# EAGLE design DEGREE_V2 (EAGLE 9.1.2)
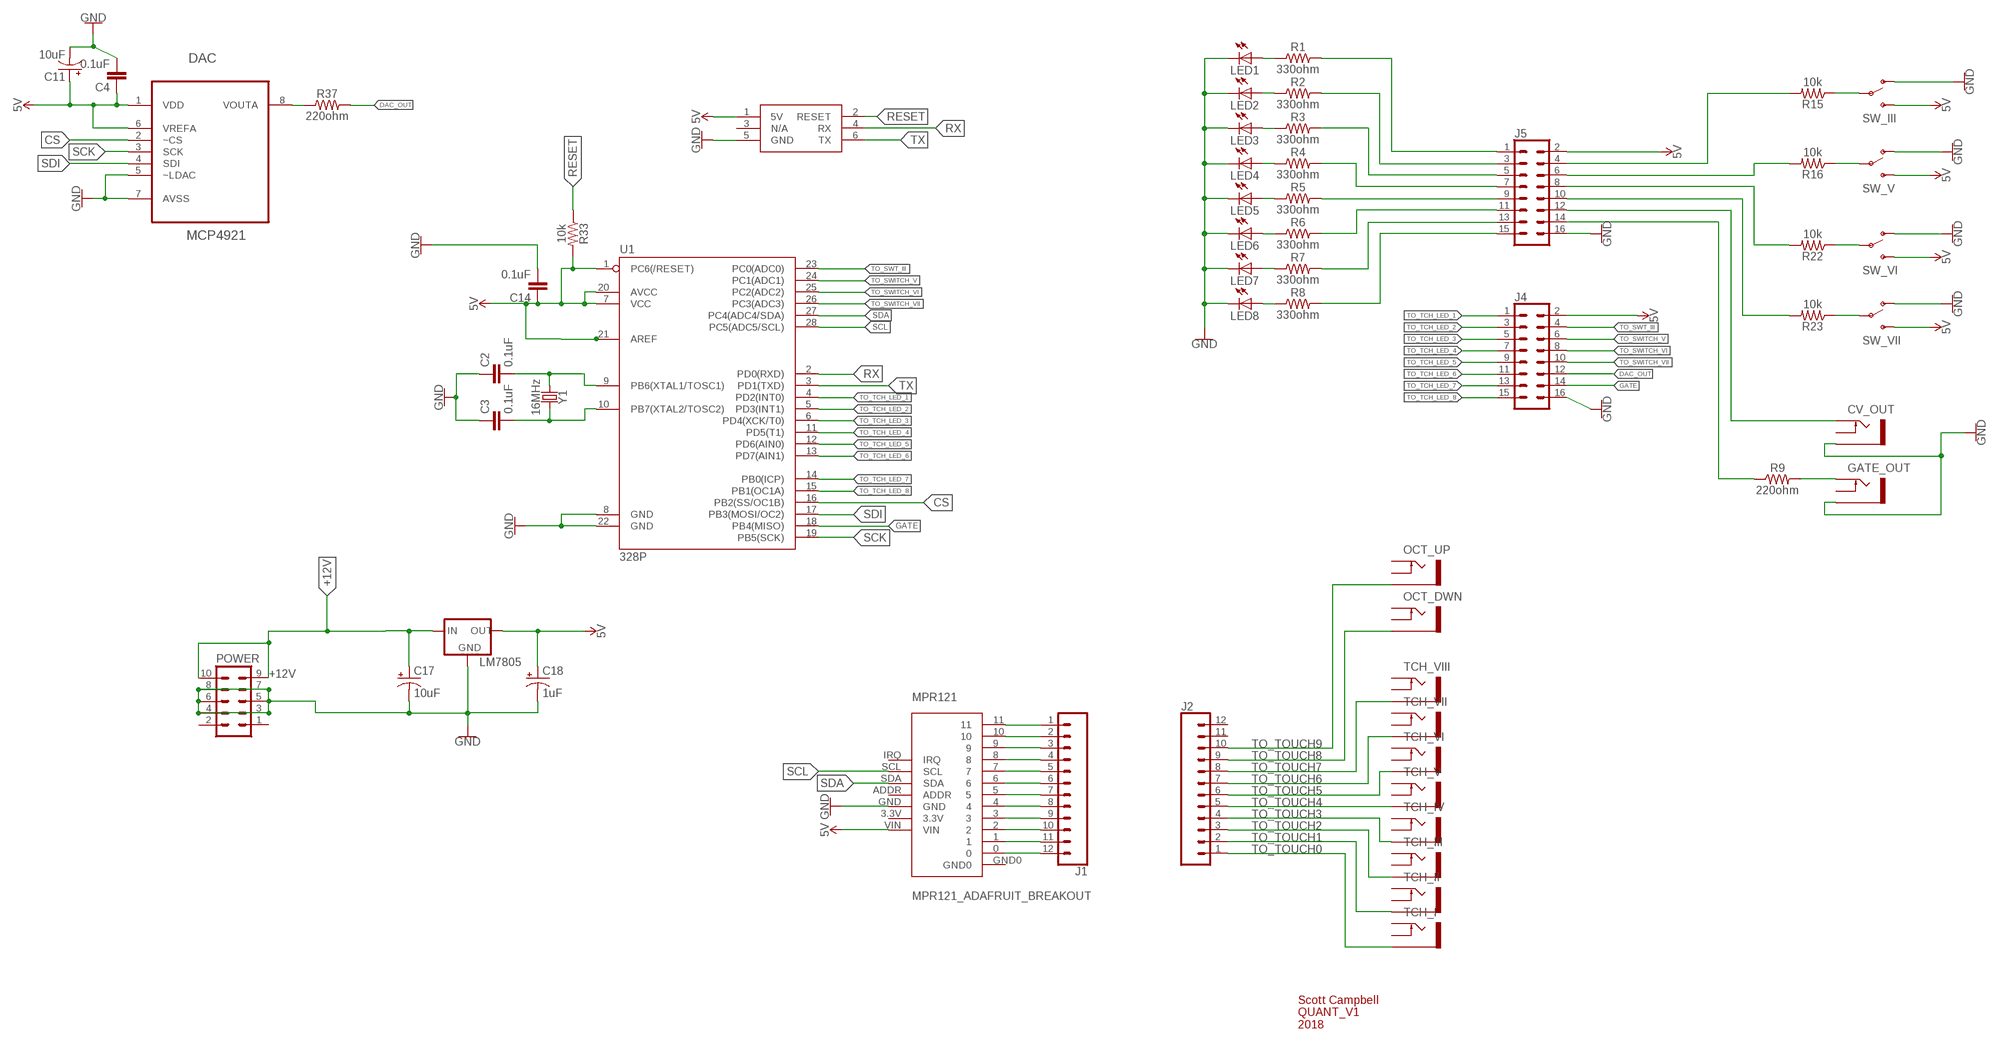
[diagram p0: schematic, sheet 1]

## Parts
C2  0.1uF  0.1UF-KIT-EZ-50V-20%  [CAP-PTH-SMALL-KIT]
C3  0.1uF  0.1UF-KIT-EZ-50V-20%  [CAP-PTH-SMALL-KIT]
C4  0.1uF  0.1UF-KIT-EZ-50V-20%  [CAP-PTH-SMALL-KIT]
C11  10uF  10UF-POLAR-RADIAL-2.5MM-25V-20%  [CPOL-RADIAL-2.5MM-5MM]
C14  0.1uF  0.1UF-KIT-EZ-50V-20%  [CAP-PTH-SMALL-KIT]
C17  10uF  10UF-POLAR-RADIAL-2.5MM-25V-20%  [CPOL-RADIAL-2.5MM-5MM]
C18  1uF  10UF-POLAR-RADIAL-2.5MM-25V-20%  [CPOL-RADIAL-2.5MM-5MM]
CV_OUT  CV_OUT  THONKICONNNEW  [WQP-PJ301M-12_JACK]
DAC  MCP4921  [DIP08]
GATE_OUT  GATE_OUT  THONKICONNNEW  [WQP-PJ301M-12_JACK]
J1  CONN_12  [1X12]
J2  CONN_12  [1X12]
J4  CONN_08X2  [2X8]
J5  CONN_08X2  [2X8]
LED1  LED3MM  [LED3MM]
LED2  LED3MM  [LED3MM]
LED3  LED3MM  [LED3MM]
LED4  LED3MM  [LED3MM]
LED5  LED3MM  [LED3MM]
LED6  LED3MM  [LED3MM]
LED7  LED3MM  [LED3MM]
LED8  LED3MM  [LED3MM]
LM7805  V_REG_78XXTO-92_UNTESTED  [TO-92]
MPR121  MPR121_ADAFRUIT_BREAKOUT  [MPR121_ADAFRUIT_BREAKOUT]
OCT_DWN  THONKICONN-ESSY  [THONKICONN-ESSY]
OCT_UP  THONKICONN-ESSY  [THONKICONN-ESSY]
POWER  EURO_POWER_HEADERREGULAR  [EURO_POWER_HEADER]
R1  330ohm  1KOHM-HORIZ-1/4W-5%  [AXIAL-0.3]
R2  330ohm  1KOHM-HORIZ-1/4W-5%  [AXIAL-0.3]
R3  330ohm  1KOHM-HORIZ-1/4W-5%  [AXIAL-0.3]
R4  330ohm  1KOHM-HORIZ-1/4W-5%  [AXIAL-0.3]
R5  330ohm  1KOHM-HORIZ-1/4W-5%  [AXIAL-0.3]
R6  330ohm  1KOHM-HORIZ-1/4W-5%  [AXIAL-0.3]
R7  330ohm  1KOHM-HORIZ-1/4W-5%  [AXIAL-0.3]
R8  330ohm  1KOHM-HORIZ-1/4W-5%  [AXIAL-0.3]
R9  220ohm  RESISTOR_HORZ  [HORIZONTAL_RESISTOR]
R15  10k  RESISTOR_HORZ  [HORIZONTAL_RESISTOR]
R16  10k  RESISTOR_HORZ  [HORIZONTAL_RESISTOR]
R22  10k  RESISTOR_HORZ  [HORIZONTAL_RESISTOR]
R23  10k  RESISTOR_HORZ  [HORIZONTAL_RESISTOR]
R33  10k  RESISTOR_HORZ  [HORIZONTAL_RESISTOR]
R37  220ohm  RESISTOR_VERT  [VERTICAL_RESISTOR]
SW_III  SUBMINI_SPDT  [SUBMINI_TOGGLE]
SW_V  SUBMINI_SPDT  [SUBMINI_TOGGLE]
SW_VI  SUBMINI_SPDT  [SUBMINI_TOGGLE]
SW_VII  SUBMINI_SPDT  [SUBMINI_TOGGLE]
TCH_I  THONKICONN-ESSY  [THONKICONN-ESSY]
TCH_II  THONKICONN-ESSY  [THONKICONN-ESSY]
TCH_III  THONKICONN-ESSY  [THONKICONN-ESSY]
TCH_IV  THONKICONN-ESSY  [THONKICONN-ESSY]
TCH_V  THONKICONN-ESSY  [THONKICONN-ESSY]
TCH_VI  THONKICONN-ESSY  [THONKICONN-ESSY]
TCH_VII  THONKICONN-ESSY  [THONKICONN-ESSY]
TCH_VIII  THONKICONN-ESSY  [THONKICONN-ESSY]
U1  328P  ATMEGA328P_PDIP  [DIP28]
U$1  ATMEGA_PROGRAMMING_PINS  [ATMEGA_PROGRAMMING_PINS]
Y1  16MHz  CRYSTAL-16MHZPTH-HC49US  [HC49US]

## Nets
5V: C4.1 C11.1(+) C14.1 C18.1(+) DAC.1(VDD) DAC.6(VREFA) J4.2 J5.2 LM7805.1(OUT) MPR121.VIN R33.2 SW_III.3(S) SW_V.3(S) SW_VI.3(S) SW_VII.3(S) U1.1(PC6(/RESET)) U1.7(VCC) U1.20(AVCC) U1.21(AREF) U$1.1(5V)
+12V: C17.1(+) LM7805.3(IN) POWER.9 POWER.10
CS: DAC.2(~CS) U1.16(PB2(SS/OC1B))
DAC_OUT: J4.12 R37.2
GATE: J4.14 U1.18(PB4(MISO))
GND: C2.1 C3.1 C4.2 C11.2(-) C14.2 C17.2(-) C18.2(-) CV_OUT.P$3_SLEEVE(SLEEVE) DAC.5(~LDAC) DAC.7(AVSS) GATE_OUT.P$3_SLEEVE(SLEEVE) J4.16 J5.16 LED1.K(C) LED2.K(C) LED3.K(C) LED4.K(C) LED5.K(C) LED6.K(C) LED7.K(C) LED8.K(C) LM7805.2(GND) MPR121.GND POWER.3 POWER.4 POWER.5 POWER.6 POWER.7 POWER.8 SW_III.1(O) SW_V.1(O) SW_VI.1(O) SW_VII.1(O) U1.8(GND) U1.22(GND) U$1.5(GND)
N$1: DAC.8(VOUTA) R37.1
N$2: GATE_OUT.P$1_TIP(TIP) R9.2
N$4: R23.1 SW_VII.COM(COMMON)
N$5: R22.1 SW_VI.COM(COMMON)
N$6: R16.1 SW_V.COM(COMMON)
N$7: R15.1 SW_III.COM(COMMON)
N$9: C3.2 U1.10(PB7(XTAL2/TOSC2)) Y1.2
N$11: C2.2 U1.9(PB6(XTAL1/TOSC1)) Y1.1
N$15: J5.4 R15.2
N$16: J5.6 R16.2
N$20: J5.8 R22.2
N$21: J1.1 MPR121.11
N$22: J5.10 R23.2
N$25: J1.2 MPR121.10
N$31: J1.3 MPR121.9
N$34: J1.4 MPR121.8
N$37: J1.5 MPR121.7
N$38: J1.6 MPR121.6
N$39: J1.7 MPR121.5
N$40: CV_OUT.P$1_TIP(TIP) J5.12
N$41: J5.14 R9.1
N$42: LED1.A R1.P$1
N$43: LED2.A R2.P$1
N$44: J1.8 MPR121.4
N$45: J1.9 MPR121.3
N$46: J1.10 MPR121.2
N$47: J1.11 MPR121.1
N$48: J1.12 MPR121.0
N$50: LED3.A R3.P$1
N$51: LED4.A R4.P$1
N$52: LED5.A R5.P$1
N$53: LED6.A R6.P$1
N$54: LED7.A R7.P$1
N$55: LED8.A R8.P$1
RESET: R33.1 U$1.2(RESET)
RX: U1.2(PD0(RXD)) U$1.4(RX)
SCK: DAC.3(SCK) U1.19(PB5(SCK))
SCL: MPR121.SCL U1.28(PC5(ADC5/SCL))
SDA: MPR121.SDA U1.27(PC4(ADC4/SDA))
SDI: DAC.4(SDI) U1.17(PB3(MOSI/OC2))
TCH_LED_1: J5.1 R1.P$2
TCH_LED_2: J5.3 R2.P$2
TCH_LED_3: J5.5 R3.P$2
TCH_LED_4: J5.7 R4.P$2
TCH_LED_5: J5.9 R5.P$2
TCH_LED_6: J5.11 R6.P$2
TCH_LED_7: J5.13 R7.P$2
TCH_LED_8: J5.15 R8.P$2
TO_SWITCH_V: J4.6 U1.24(PC1(ADC1))
TO_SWITCH_VI: J4.8 U1.25(PC2(ADC2))
TO_SWITCH_VII: J4.10 U1.26(PC3(ADC3))
TO_SWT_III: J4.4 U1.23(PC0(ADC0))
TO_TCH_LED_1: J4.1 U1.4(PD2(INT0))
TO_TCH_LED_2: J4.3 U1.5(PD3(INT1))
TO_TCH_LED_3: J4.5 U1.6(PD4(XCK/T0))
TO_TCH_LED_4: J4.7 U1.11(PD5(T1))
TO_TCH_LED_5: J4.9 U1.12(PD6(AIN0))
TO_TCH_LED_6: J4.11 U1.13(PD7(AIN1))
TO_TCH_LED_7: J4.13 U1.14(PB0(ICP))
TO_TCH_LED_8: J4.15 U1.15(PB1(OC1A))
TO_TOUCH0: J2.1 TCH_I.P$3_SLEEVE(SLEEVE)
TO_TOUCH1: J2.2 TCH_II.P$3_SLEEVE(SLEEVE)
TO_TOUCH2: J2.3 TCH_III.P$3_SLEEVE(SLEEVE)
TO_TOUCH3: J2.4 TCH_IV.P$3_SLEEVE(SLEEVE)
TO_TOUCH4: J2.5 TCH_V.P$3_SLEEVE(SLEEVE)
TO_TOUCH5: J2.6 TCH_VI.P$3_SLEEVE(SLEEVE)
TO_TOUCH6: J2.7 TCH_VII.P$3_SLEEVE(SLEEVE)
TO_TOUCH7: J2.8 TCH_VIII.P$3_SLEEVE(SLEEVE)
TO_TOUCH8: J2.9 OCT_DWN.P$3_SLEEVE(SLEEVE)
TO_TOUCH9: J2.10 OCT_UP.P$3_SLEEVE(SLEEVE)
TX: U1.3(PD1(TXD)) U$1.6(TX)
Unconnected: CV_OUT.P$2_SWITCH(SWITCH) GATE_OUT.P$2_SWITCH(SWITCH) J2.11 J2.12 MPR121.3.3V MPR121.ADDR MPR121.GND0 MPR121.IRQ OCT_DWN.P$1_TIP(TIP) OCT_DWN.P$2_SWITCH(SWITCH) OCT_UP.P$1_TIP(TIP) OCT_UP.P$2_SWITCH(SWITCH) POWER.1 POWER.2 TCH_I.P$1_TIP(TIP) TCH_I.P$2_SWITCH(SWITCH) TCH_II.P$1_TIP(TIP) TCH_II.P$2_SWITCH(SWITCH) TCH_III.P$1_TIP(TIP) TCH_III.P$2_SWITCH(SWITCH) TCH_IV.P$1_TIP(TIP) TCH_IV.P$2_SWITCH(SWITCH) TCH_V.P$1_TIP(TIP) TCH_V.P$2_SWITCH(SWITCH) TCH_VI.P$1_TIP(TIP) TCH_VI.P$2_SWITCH(SWITCH) TCH_VII.P$1_TIP(TIP) TCH_VII.P$2_SWITCH(SWITCH) TCH_VIII.P$1_TIP(TIP) TCH_VIII.P$2_SWITCH(SWITCH) U$1.3(N/A)

## Notes on the sheet
- Scott Campbell
  QUANT_V1
  2018

## Library data of the parts
C2-C4 C14 = SparkFun-Capacitors:0.1UF: 0.1µF ceramic capacitors A capacitor is a passive two-terminal electrical component used to store electrical energy temporarily in an electric field.; PROD_ID: CAP-08370
C11 C17 = SparkFun-Capacitors:10UF-POLAR: 10.0µF polarized capacitors A capacitor is a passive two-terminal electrical component used to store electrical energy temporarily in an electric field.; PROD_ID: CAP-08440
C18 = SparkFun-Capacitors:10UF-POLAR: 10.0µF polarized capacitors A capacitor is a passive two-terminal electrical component used to store electrical energy temporarily in an electric field.; PROD_ID: CAP-08440; VALUE: 10uF
CV_OUT GATE_OUT = MusicThingModular:THONKICONN: 3.5mm socket for Eurorack modular synths
DAC = ESSY:MCP4921
J1 J2 = SparkFun-Connectors:CONN_12: Multi connection point. Often used as Generic Header-pin footprint for 0.1 inch spaced/style header connections On any of the 0.1 inch spaced packages, you can populate with these: Break Away Headers - Straight <https://www.sparkfun.com/products/116> (PRT-00116) Break Away Male Headers - Right Angle <https://www.sparkfun.com/products/553> (PRT-00553) Female Headers <https://www.sparkfun.com/products/115> (PRT-00115) Break Away Headers - Machine Pin <https://www.sparkfun.com/products/117> (PRT-00117) Break Away Female Headers - Swiss Machine Pin <https://www.sparkfun.com/products/743> (PRT-00743) For SCREWTERMINALS and SPRING TERMINALS visit here: Screw Terimnals on SparkFun.com <https://www.sparkfun.com/search/results?term=Screw+Terminals> (5mm/3.5mm/2.54mm spacing) This device is also useful as a general connection point to wire up your design to another part of your project. Our various solder wires solder well into these plated through hole pads. Hook-Up Wire - Assortment (Stranded, 22 AWG) <https://www.sparkfun.com/products/11375> (PRT-11375) Hook-Up Wire - Assortment (Solid Core, 22 AWG) <https://www.sparkfun.com/products/11367> (PRT-11367) View the entire wire category on our website here <https://www.sparkfun.com/categories/141> Special notes: Molex polarized connector foot print use with SKU : PRT-08231 with associated crimp pins and housings. 1MM SMD Version SKU: PRT-10208 NOTES ON THE VARIANTS LOCK and LOCK_LONGPADS... This footprint was designed to help hold the alignment of a through-hole component (i.e. 6-pin header) while soldering it into place. You may notice that each hole has been shifted either up or down by 0.005 of an inch from it's more standard position (which is a perfectly straight line). This slight alteration caused the pins (the squares in the middle) to touch the edges of the holes. Because they are alternating, it causes a "brace" to hold the component in place. 0.005 has proven to be the perfect amount of "off-center" position when using our standard breakaway headers. Although looks a little odd when you look at the bare footprint, once you have a header in there, the alteration is very hard to notice. Also,if you push a header all the way into place, it is covered up entirely on the bottom side.
J4 J5 = SparkFun-Connectors:CONN_08X2: Multi connection point. Often used as Generic Header-pin footprint for 0.1 inch spaced/style header connections You can populate with any combo of single row headers, but if you'd like an exact match, check this: Header - 2x8 (Male, 0.1") <https://www.sparkfun.com/products/13156> (PRT-13156) On any of the 0.1 inch spaced packages, you can populate with these: Break Away Headers - Straight <https://www.sparkfun.com/products/116> (PRT-00116) Break Away Male Headers - Right Angle <https://www.sparkfun.com/products/553> (PRT-00553) Female Headers <https://www.sparkfun.com/products/115> (PRT-00115) Break Away Headers - Machine Pin <https://www.sparkfun.com/products/117> (PRT-00117) Break Away Female Headers - Swiss Machine Pin <https://www.sparkfun.com/products/743> (PRT-00743)
LED1-LED8 = adafruit:LED: LED OSRAM: - CHIPLED LG R971, LG N971, LY N971, LG Q971, LY Q971, LO R971, LY R971 LH N974, LH R974 LS Q976, LO Q976, LY Q976 LO Q996 - Hyper CHIPLED LW Q18S LB Q993, LB Q99A, LB R99A - SideLED LS A670, LO A670, LY A670, LG A670, LP A670 LB A673, LV A673, LT A673, LW A673 LH A674 LY A675 LS A676, LA A676, LO A676, LY A676, LW A676 LS A679, LY A679, LG A679 - Hyper Micro SIDELED® LS Y876, LA Y876, LO Y876, LY Y876 LT Y87S - SmartLED LW L88C, LW L88S LB L89C, LB L89S, LG L890 LS L89K, LO L89K, LY L89K LS L896, LA L896, LO L896, LY L896 - TOPLED LS T670, LO T670, LY T670, LG T670, LP T670 LSG T670, LSP T670, LSY T670, LOP T670, LYG T670 LG T671, LOG T671, LSG T671 LB T673, LV T673, LT T673, LW T673 LH T674 LS T676, LA T676, LO T676, LY T676, LB T676, LH T676, LSB T676, LW T676 LB T67C, LV T67C, LT T67C, LS T67K, LO T67K, LY T67K, LW E67C LS E67B, LA E67B, LO E67B, LY E67B, LB E67C, LV E67C, LT E67C LW T67C LS T679, LY T679, LG T679 LS T770, LO T770, LY T770, LG T770, LP T770 LB T773, LV T773, LT T773, LW T773 LH T774 LS E675, LA E675, LY E675, LS T675 LS T776, LA T776, LO T776, LY T776, LB T776 LHGB T686 LT T68C, LB T68C - Hyper Mini TOPLED® LB M676 - Mini TOPLED Santana® LG M470 LS M47K, LO M47K, LY M47K Source: http://www.osram.convergy.de/
LM7805 = SparkFun-IC-Power:V_REG_78XX: Voltage Regulator Standard 78xx regulator. IGO (Input Ground Output). Spark Fun Electronics SKU : COM-00107
MPR121 = ESSY:MPR121_ADAFRUIT_BREAKOUT
OCT_DWN OCT_UP TCH_I TCH_II TCH_III TCH_IV TCH_V TCH_VI TCH_VII TCH_VIII = ESSY:THONKICONN-ESSY
POWER = MusicThingModular:EURO_POWER_HEADER: Power Header 10 pin power header for Eurorack Power Supplies Variants with fatter pads for easier soldering, and the LOCK variant which has 5mil offset pins to hold the component in place before soldering
R1-R8 = SparkFun-Resistors:1KOHM: 1kΩ resistor A resistor is a passive two-terminal electrical component that implements electrical resistance as a circuit element. Resistors act to reduce current flow, and, at the same time, act to lower voltage levels within circuits. - Wikipedia; PROD_ID: RES-08380; VALUE: 1k
R9 R15 R16 R22 R23 R33 = ESSY:RESISTOR_HORZ
R37 = ESSY:RESISTOR_VERT
SW_III SW_V SW_VI SW_VII = MusicThingModular:SUBMINI_SPDT
U1 = SparkFun-IC-Microcontroller:ATMEGA328P_PDIP: Atmel 328P Through hole ATMEGA328P uC used in the Arduino 32kb flash, 1k EEPROM, 2k SRAM Datasheet <http://www.sparkfun.com/datasheets/Components/SMD/ATMega328.pdf> SparkFun Products Storefront component: AVR 28 Pin 20MHz 32K 6A/D - ATMega328P <https://www.sparkfun.com/products/9061> (COM-09061) SparkFun Simon Says - Through-Hole Soldering Kit <https://www.sparkfun.com/products/10547> (KIT-10547) SparkFun Learn to Solder - Simon Says <https://www.sparkfun.com/products/13708> (KIT-13708) SparkFun BigTime Watch Kit <https://www.sparkfun.com/products/11734> (KIT-11734) SparkFun ClockIt <https://www.sparkfun.com/products/10930> (KIT-10930) SparkFun Serial Enabled LCD Kit <https://www.sparkfun.com/products/10097> (LCD-10097) SparkFun Simon Tilts - Through Hole Soldering Kit <https://www.sparkfun.com/products/12634> (KIT-12634) SparkFun Frequency Counter Kit <https://www.sparkfun.com/products/10140> (KIT-10140) FabFM Radio Kit <https://www.sparkfun.com/products/11043> (KIT-11043) SparkFun Binary Blaster Kit <https://www.sparkfun.com/products/12037> (KIT-12037) SparkFun Metro-Gnome <https://www.sparkfun.com/products/9236> (KIT-09236) ATmega328 with Arduino Optiboot (Uno) <https://www.sparkfun.com/products/10524> (DEV-10524); PROD_ID: IC-09136
U$1 = ESSY:ATMEGA_PROGRAMMING_PINS
Y1 = SparkFun-Clocks:CRYSTAL-16MHZ: 16MHz Crystal Digikey Example <http://www.digikey.com/product-search/en?keywords=535-9122-1-ND> Frequency: 16MHz Frequency Stability: ±50ppm Frequency Tolerance: ±20ppm Load Capacitance: 18pF SparkFun Products: Pro Micro -5V/16MHz <https://www.sparkfun.com/products/12640> SparkFun Serial Enabled LCD Kit <https://www.sparkfun.com/products/10097>; PROD_ID: XTAL-08181; SF_ID: COM-00536

## Board
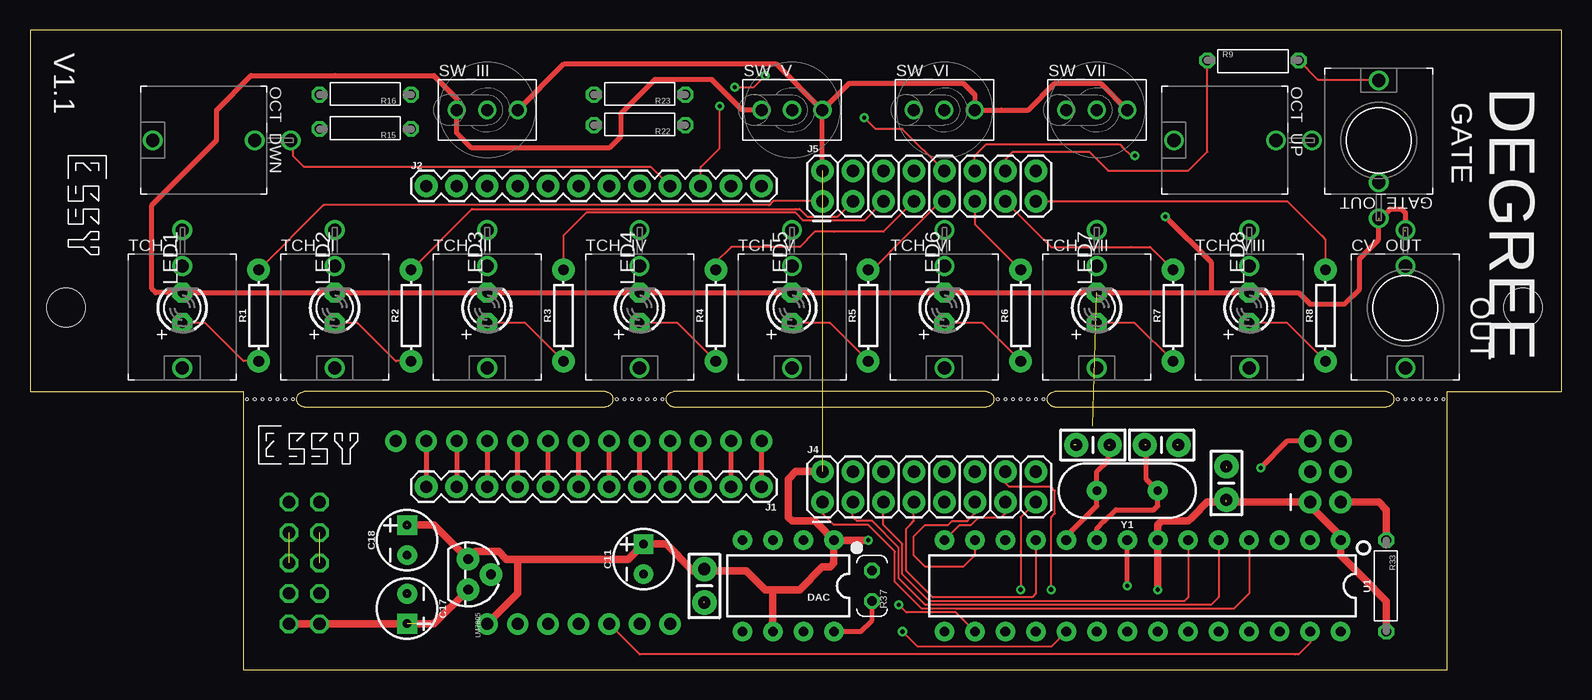
[diagram p1: board, top side]
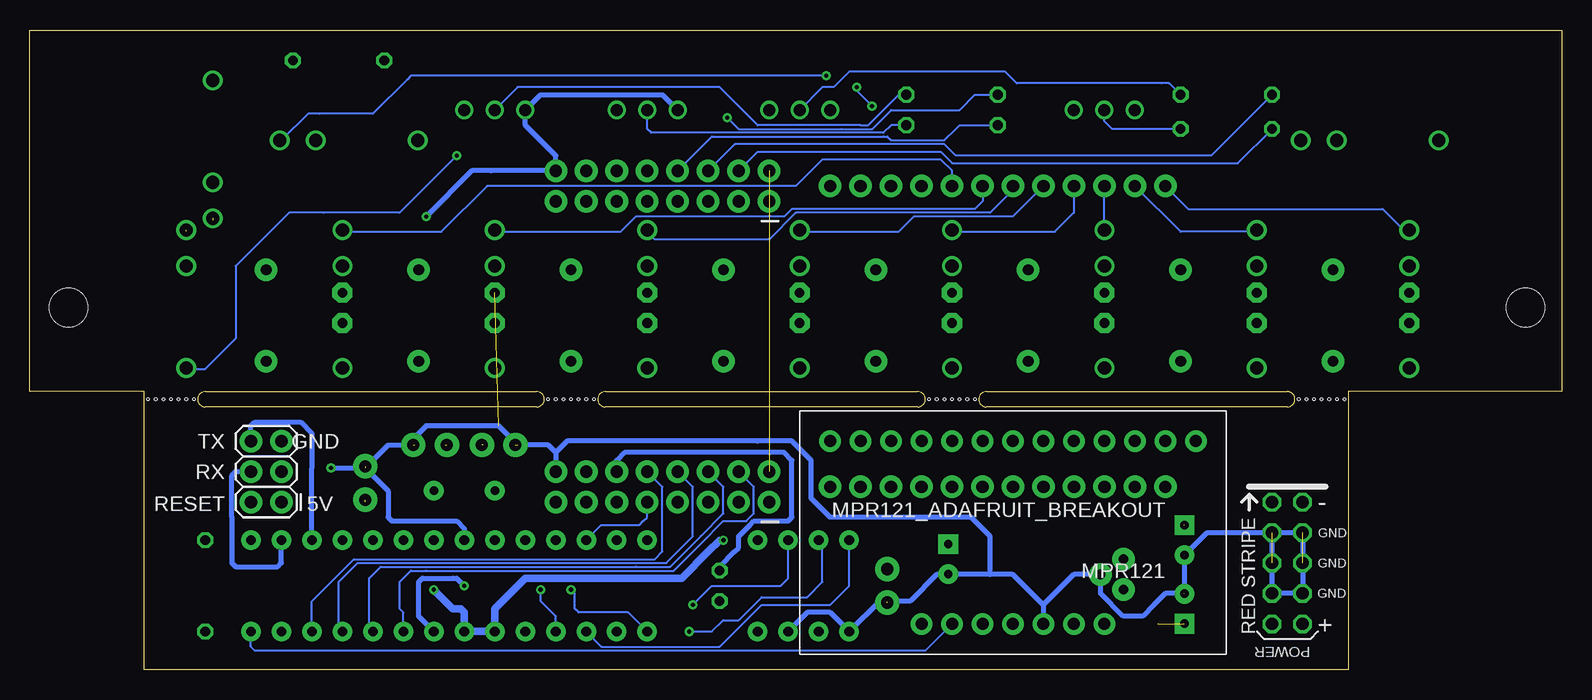
[diagram p2: board, bottom side, seen from below]

Size 127.64 x 53.34 mm. Coordinates in mm from the lower left corner, seen from the top.
Outline: 17.78,0 118.11,0 118.11,23.18 127.64,23.18 127.64,53.34 0,53.33 0,23.18 17.78,23.18 17.78,0
Outline: 22.86,21.91 47.94,21.91 arc180 47.94,23.18 22.86,23.18 arc180 22.86,21.91
Outline: 85.41,21.91 113.03,21.91 arc180 113.03,23.18 85.41,23.18 arc180 85.41,21.91
Outline: 53.66,21.91 79.69,21.91 arc180 79.69,23.18 53.66,23.18 arc180 53.66,21.91
Copper layers (1*16): Top 0.035mm / dielectric 1.5mm / Bottom 0.035mm
Design rules "default": minimum track width 6mil, minimum drill 0.35mm, track to track 6mil, track to pad 6mil, pad to pad 6mil, via to via 6mil, smd to smd 6mil, copper to edge 40mil, drill to drill 6mil, minimum pad ring 10mil, minimum via ring 8mil, stop-mask expansion 4mil, vias tented up to drill 0mil, thermal gap 10mil
Holes 0.2 mm at 18.1,22.54 18.73,22.54 19.37,22.54 20,22.54 20.64,22.54 81.92,22.54 82.55,22.54 83.19,22.54 83.82,22.54 84.45,22.54 115.25,22.54 115.89,22.54 116.52,22.54 117.16,22.54 117.79,22.54 48.9,22.54 49.53,22.54 50.16,22.54 50.8,22.54 51.44,22.54 81.28,22.54 80.64,22.54 52.07,22.54 52.7,22.54 21.27,22.54 21.91,22.54 114.62,22.54 113.98,22.54

### Footprints (pad centres in the part's own frame; a part is rotated, then mirrored left to right if it is on the bottom)
CAP-PTH-SMALL-KIT = drill 1.016 pad 2.032: 1 -1.397,0; 2 1.397,0
CPOL-RADIAL-2.5MM-5MM = drill 0.7 pad 1.651 square: 1 1.25,0 | drill 0.7 pad 1.651: 2 -1.25,0
WQP-PJ301M-12_JACK = drill 1.1: P$1_TIP 0,5; P$2_SWITCH 0,-3.5; P$3_SLEEVE 0,-6.5
DIP08 = drill 0.813 pad 1.626: 1 -3.81,-3.81; 2 -1.27,-3.81; 3 1.27,-3.81; 4 3.81,-3.81; 5 3.81,3.81; 6 1.27,3.81; 7 -1.27,3.81; 8 -3.81,3.81
1X12 = drill 1.016 pad 1.88: 1 0,0; 2 2.54,0; 3 5.08,0; 4 7.62,0; 5 10.16,0; 6 12.7,0; 7 15.24,0; 8 17.78,0; 9 20.32,0; 10 22.86,0; 11 25.4,0; 12 27.94,0
2X8 = drill 1.016 pad 1.88: 1 0,0; 2 0,2.54; 3 2.54,0; 4 2.54,2.54; 5 5.08,0; 6 5.08,2.54; 7 7.62,0; 8 7.62,2.54; 9 10.16,0; 10 10.16,2.54; 11 12.7,0; 12 12.7,2.54; 13 15.24,0; 14 15.24,2.54; 15 17.78,0; 16 17.78,2.54
LED3MM = drill 0.813 pad 1.676 octagon: A -1.27,0; K 1.27,0
TO-92 = drill 0.813 pad 1.88: 1 -1.27,0; 2 0,1.905; 3 1.27,0
MPR121_ADAFRUIT_BREAKOUT = drill 1 pad 1.778: 0 17.78,-30.48; 1 17.78,-27.94; 2 17.78,-25.4; 3 17.78,-22.86; 3.3V 2.54,-22.86; 4 17.78,-20.32; 5 17.78,-17.78; 6 17.78,-15.24; 7 17.78,-12.7; 8 17.78,-10.16; 9 17.78,-7.62; 10 17.78,-5.08; 11 17.78,-2.54; ADDR 2.54,-17.78; GND 2.54,-20.32; GND0 17.78,-33.02; IRQ 2.54,-10.16; SCL 2.54,-12.7; SDA 2.54,-15.24; VIN 2.54,-25.4
THONKICONN-ESSY = drill 1.1: P$1_TIP 0,5; P$2_SWITCH 0,-3.5; P$3_SLEEVE 0,-6.5
EURO_POWER_HEADER = drill 1.016 octagon: 1 -5.08,-1.27; 2 -5.08,1.27; 3 -2.54,-1.27; 4 -2.54,1.27; 5 0,-1.27; 6 0,1.27; 7 2.54,-1.27; 8 2.54,1.27; 9 5.08,-1.27; 10 5.08,1.27
AXIAL-0.3 = drill 0.9 pad 1.88: P$1 -3.81,0; P$2 3.81,0
HORIZONTAL_RESISTOR = drill 0.813 octagon: 1 -3.81,0; 2 3.81,0
VERTICAL_RESISTOR = drill 0.813 octagon: 1 -1.27,0; 2 1.27,0
SUBMINI_TOGGLE = drill 1 pad 1.422: 1 -2.54,0; 3 2.54,0; COM 0,0
DIP28 = drill 0.813 pad 1.626: 1 -16.51,-3.81; 2 -13.97,-3.81; 3 -11.43,-3.81; 4 -8.89,-3.81; 5 -6.35,-3.81; 6 -3.81,-3.81; 7 -1.27,-3.81; 8 1.27,-3.81; 9 3.81,-3.81; 10 6.35,-3.81; 11 8.89,-3.81; 12 11.43,-3.81; 13 13.97,-3.81; 14 16.51,-3.81; 15 16.51,3.81; 16 13.97,3.81; 17 11.43,3.81; 18 8.89,3.81; 19 6.35,3.81; 20 3.81,3.81; 21 1.27,3.81; 22 -1.27,3.81; 23 -3.81,3.81; 24 -6.35,3.81; 25 -8.89,3.81; 26 -11.43,3.81; 27 -13.97,3.81; 28 -16.51,3.81
ATMEGA_PROGRAMMING_PINS = drill 1.016 pad 1.88: 1 0,0; 2 0,2.54; 3 2.54,0; 4 2.54,2.54; 5 5.08,0; 6 5.08,2.54
EURO_PANEL_SCREW_HOLE = hole 3.2: -0.032,0.032
HC49US = drill 0.7 pad 1.651: 1 -2.54,0; 2 2.54,0

### Placement (x,y rotation side)
C2  94.3,18.73 180 top
C3  88.58,18.73 0 top
C4  56.2,6.99 270 top
C11  51.12,9.21 90 top
C14  99.69,15.56 90 top
C17  31.43,5.08 270 top
C18  31.43,10.79 90 top
CV_OUT  114.62,30.16 180 top
DAC  63.18,6.99 180 top
GATE_OUT  112.39,44.13 0 top
J1  60.96,15.24 180 top
J2  33.02,40.32 0 top
J4  66.04,13.97 0 top
J5  66.04,39.05 0 top
LED1  12.7,30.16 90 top
LED2  25.4,30.16 90 top
LED3  38.1,30.16 90 top
LED4  50.8,30.16 90 top
LED5  63.5,30.16 90 top
LED6  76.2,30.16 90 top
LED7  88.9,30.16 90 top
LED8  101.6,30.16 90 top
LM7805  36.51,7.94 270 top
MPR121  63.5,1.27 90 bottom
OCT_DWN  15.24,44.13 90 top
OCT_UP  100.33,44.13 90 top
POWER  22.86,8.89 270 bottom
R1  19.05,29.53 90 top
R2  31.75,29.53 90 top
R3  44.45,29.53 90 top
R4  57.15,29.53 90 top
R5  69.85,29.53 90 top
R6  82.55,29.53 90 top
R7  95.25,29.53 90 top
R8  107.95,29.53 90 top
R9  101.92,50.8 0 top
R15  27.94,45.09 180 top
R16  27.94,47.94 180 top
R22  50.8,45.4 180 top
R23  50.8,47.94 180 top
R33  113.03,6.99 270 top
R37  70.17,6.99 90 top
SW_III  38.1,46.67 0 top
SW_V  63.5,46.67 0 top
SW_VI  76.2,46.67 0 top
SW_VII  88.9,46.67 0 top
TCH_I  12.7,30.16 180 top
TCH_II  25.4,30.16 180 top
TCH_III  38.1,30.16 180 top
TCH_IV  50.8,30.16 180 top
TCH_V  63.5,30.16 180 top
TCH_VI  76.2,30.16 180 top
TCH_VII  88.9,30.16 180 top
TCH_VIII  101.6,30.16 180 top
U1  92.71,6.99 180 top
U$1  106.68,13.97 90 bottom
U$2  [LOGO_SM]  6.35,42.86 270 top
U$3  [EURO_PANEL_SCREW_HOLE]  3.04,30.16 0 top
U$4  [EURO_PANEL_SCREW_HOLE]  124.46,30.16 0 top
U$6  [LOGO_SM]  19.05,20.32 0 top
Y1  91.44,14.92 180 top

### Tracks (layer width: path | path; a pad name or v marks a point on that pad's centre or on a via)
5V  (via drill 0.35)  (3 unrouted)
  Top 0.152: LM7805.1 36.83,9.21 | C11.1 51.12,10.48 | C4.1 56.2,8.26
  Top 0.406: J5.2 SW_V.3 | 106.68,13.65 U$1.1 | SW_V.3 68.26,48.9 77.79,48.9 78.74,47.94 SW_VI.3 80.96,46.67 83.19,46.67 85.41,48.9 89.22,48.9 SW_VII.3 | SW_V.3 62.23,50.48 44.45,50.48 SW_III.3
  Top 0.61: 106.68,13.65 107.95,12.38 109.22,11.11 U1.1 109.22,9.52 111.12,7.62 113.03,5.71 R33.2 | 40.64,9.21 45.4,9.21 49.85,9.21 51.12,10.48 53.02,10.48 55.24,8.26 56.2,8.26 59.69,8.26 61.28,6.67 61.91,6.67 | 40.64,9.21 39.69,9.21 39.05,9.84 37.15,9.84 LM7805.1 33.66,12.07 31.43,12.07 | MPR121.VIN 40.64,6.35 40.64,9.21 | U$1.1 101.6,13.97 99.69,13.97 98.11,13.97 96.84,12.7 96.52,12.38 95.89,12.38 94.3,12.38 93.98,12.07 U1.7 | 61.91,6.67 64.14,6.67 66.04,8.57 66.67,8.57 66.99,8.89 DAC.1 | DAC.6 61.91,6.67 | v69.85,10.79 DAC.1 | DAC.1 65.72,12.07 65.41,12.38 63.5,12.38 63.18,12.7 63.18,15.56 63.18,15.87 63.82,16.51 J4.2 | U1.7 93.98,11.11 | U1.7 v93.98,6.67
  Bottom 0.61: v93.98,6.67 92.39,5.08 91.76,5.08 91.44,4.76 91.44,4.45 U1.21 U1.20 88.9,5.08 86.36,7.62 73.34,7.62 71.12,9.84 70.17,10.79 v69.85,10.79
+12V  (1 unrouted)
  Top 0.61: POWER.10 POWER.9 33.66,3.81 LM7805.3
CS  (via drill 0.35)
  Top 0.152: U1.16 77.15,4.76 73.03,4.76 v72.39,5.4
  Bottom 0.152: v72.39,5.4 70.8,6.99 65.09,6.99 64.45,7.62 DAC.2
DAC_OUT
  Bottom 0.406: R37.2 70.17,8.57 68.9,9.84 68.58,10.16 68.58,11.11 67.63,12.07 67.31,12.38 65.09,12.38 64.45,12.38 64.14,12.7 64.14,17.46 64.77,18.1 78.11,18.1 78.74,17.46 J4.12
GATE  (via drill 0.35)
  Top 0.152: v85.09,6.67 85.09,12.7 85.41,13.02 85.41,14.92 85.09,15.24 81.6,15.24 81.28,15.56 J4.14
  Bottom 0.152: U1.18 83.82,4.45 84.77,5.4 85.09,5.71 v85.09,6.67
GND  (via drill 0.35)  (12 unrouted)
  Top 0.152: SW_III.1 35.56,46.36
  Top 0.406: U$1.5 104.78,19.05 v102.55,16.83 | v91.44,6.99 U1.8 | 98.42,31.43 LED7.K LED6.K LED5.K LED4.K LED3.K LED2.K LED1.K 10.48,31.43 10.16,31.75 10.16,35.56 10.16,38.73 10.48,39.05 15.56,44.13 15.56,45.08 15.56,46.67 18.41,49.53 25.4,49.53 33.66,49.53 34.29,48.9 35.56,47.62 SW_III.1 35.56,44.77 36.83,43.5 48.26,43.5 49.21,44.45 49.21,46.36 50.48,47.62 52.07,49.21 56.83,49.21 59.37,46.67 SW_V.1 | 98.42,31.43 LED8.K 105.41,31.43 105.73,31.43 106.68,30.48 109.54,30.48 110.81,31.75 110.81,34.29 112.39,35.88 112.39,37.47 113.35,38.42 114.3,38.42 114.62,38.1 114.62,36.51 | v94.61,37.78 98.42,33.97 98.42,31.43
  Bottom 0.406: 43.18,5.4 40.64,7.94 LM7805.2 38.42,6.35 36.51,4.45 35.88,4.45 34.92,4.45 33.97,5.4 33.02,6.35 31.43,6.35 31.43,9.52 29.53,11.43 POWER.3 | 43.18,5.4 MPR121.GND | 43.18,5.4 45.72,7.94 47.62,7.94 | 47.62,7.94 51.12,7.94 52.07,7.94 54.29,5.71 56.2,5.71 56.83,5.71 DAC.5 60.96,4.76 62.87,4.76 DAC.7 | 47.62,7.94 47.62,11.11 49.21,12.7 60.33,12.7 60.96,12.7 62.55,14.29 62.55,17.46 64.14,19.05 66.99,19.05 82.87,19.05 83.82,18.1 | v102.55,16.83 99.69,16.83 | 99.69,16.83 97.79,18.73 95.57,18.73 95.57,19.37 94.61,20.32 88.58,20.32 87,18.73 84.45,18.73 83.82,18.1 | 83.82,18.1 J4.16 | 99.69,16.83 97.79,14.92 97.79,12.7 97.47,12.38 92.08,12.38 91.44,11.75 U1.8 | U1.22 95.25,4.45 95.25,7.3 94.93,7.62 92.39,7.62 92.08,7.62 v91.44,6.99 | POWER.3 POWER.4 POWER.8 POWER.7 POWER.3 | v94.61,37.78 90.81,41.59 89.22,41.59 J5.16 83.82,42.86 86.36,45.4 SW_VII.1 85.09,47.94 75.88,47.94 74.93,47.94 SW_VI.1
N$1
  Top 0.406: DAC.8 69.22,3.17 70.17,4.13 R37.1
N$2
  Top 0.152: R9.2 107.31,49.21 111.76,49.21 112.31,49.21 GATE_OUT.P$1_TIP
N$4
  Bottom 0.152: SW_VII.COM 87,48.58 71.44,48.58 70.17,48.58 68.9,47.31 66.99,45.4 58.42,45.4 57.78,45.4 55.24,47.94 R23.1
N$5
  Bottom 0.152: R22.1 55.88,45.4 56.52,44.77 75.88,44.77 76.2,45.08 SW_VI.COM
N$6
  Bottom 0.152: R16.1 32.7,48.9 33.34,48.9 45.4,48.9 46.04,49.53 46.35,49.85 59.37,49.85 60.64,48.58 60.96,48.58 61.59,48.58 SW_V.COM
N$7
  Bottom 0.152: R15.1 37.47,45.08 38.1,45.72 SW_III.COM
N$9  (1 unrouted)
  Top 0.406: U1.10 86.36,11.11 88.9,13.65 Y1.2 88.9,16.51 89.85,17.46 89.85,18.73
N$11  (1 unrouted)
  Top 0.406: U1.9 88.9,11.75 89.53,12.38 90.49,13.34 93.66,13.34 93.98,13.65 Y1.1 93.03,15.87 93.03,18.73
N$15
  Bottom 0.152: J5.4 66.99,43.18 66.67,43.18 51.75,43.18 50.8,42.23 26.99,42.23 R15.2
N$16
  Bottom 0.152: R16.2 29.21,42.86 37.78,42.86 50.48,42.86 51.44,43.82 68.9,43.82 J5.6
N$20
  Bottom 0.152: J5.8 70.8,44.45 56.52,44.45 56.2,44.45 55.88,44.13 51.44,44.13 50.48,45.08 50.16,45.4 R22.2
N$21
  Top 0.406: J1.1 MPR121.11
N$22  (via drill 0.35)
  Top 0.152: J5.10 72.71,45.08 71.12,45.08 70.48,45.08 v69.53,46.04
  Bottom 0.152: v69.53,46.04 68.58,45.08 60.01,45.08 57.47,45.08 55.88,46.67 50.16,46.67 48.9,47.94 R23.2
N$25
  Top 0.406: J1.2 MPR121.10
N$31
  Top 0.406: J1.3 MPR121.9
N$34
  Top 0.406: J1.4 MPR121.8
N$37
  Top 0.406: J1.5 MPR121.7
N$38
  Top 0.406: J1.6 MPR121.6
N$39
  Top 0.406: J1.7 MPR121.5
N$40  (via drill 0.35)
  Top 0.152: J5.12 78.74,42.86 79.06,43.18 79.69,43.82 88.9,43.82 90.81,43.82 91.12,43.5 91.76,42.86 v92.08,42.86
  Bottom 0.152: v92.08,42.86 96.84,38.1 103.19,38.1 106.05,38.1 110.17,33.97 110.49,33.65 110.49,27.62 113.03,25.08 114.62,25.08 CV_OUT.P$1_TIP
N$41
  Top 0.152: J5.14 81.28,42.54 81.92,43.18 88.27,43.18 89.85,41.59 96.52,41.59 98.11,43.18 R9.1
N$42
  Top 0.152: R1.P$1 17.78,25.72 14.61,28.89 LED1.A
N$43
  Top 0.152: R2.P$1 30.48,25.72 27.3,28.89 LED2.A
N$44
  Top 0.406: J1.8 MPR121.4
N$45
  Top 0.406: J1.9 MPR121.3
N$46
  Top 0.406: MPR121.2 J1.10
N$47
  Top 0.406: MPR121.1 J1.11
N$48
  Top 0.406: MPR121.0 J1.12
N$50
  Top 0.152: R3.P$1 41.27,28.89 LED3.A
N$51
  Top 0.152: R4.P$1 53.98,28.89 LED4.A
N$52
  Top 0.152: R5.P$1 66.67,28.89 LED5.A
N$53
  Top 0.152: R6.P$1 79.38,28.89 LED6.A
N$54
  Top 0.152: R7.P$1 92.08,28.89 LED7.A
N$55
  Top 0.152: R8.P$1 104.78,28.89 LED8.A
RESET
  Top 0.61: U$1.2 112.39,13.97 113.03,13.34 R33.1
RX
  Bottom 0.406: U$1.4 110.49,16.51 110.81,16.19 110.81,12.7 110.81,8.89 110.49,8.57 107,8.57 106.68,8.89 U1.2
SCK  (via drill 0.35)
  Top 0.152: U1.19 85.09,1.9 73.98,1.9 v72.71,3.17
  Bottom 0.152: v72.71,3.17 70.8,3.17 69.85,4.13 68.58,4.13 66.67,6.03 62.87,6.03 61.59,7.3 61.59,10.48 DAC.3
SCL
  Bottom 0.152: MPR121.SCL 53.02,1.59 53.98,1.59 86.68,1.59 108.27,1.59 108.9,1.59 109.22,1.9 U1.28
SDA
  Top 0.152: U1.27 106.68,2.22 106.36,1.9 105.73,1.27 105.41,1.27 50.8,1.27 MPR121.SDA
SDI
  Bottom 0.152: DAC.4 59.37,6.99 60.96,5.4 66.67,5.4 70.17,1.9 80.01,1.9 U1.17
TCH_LED_1
  Top 0.152: J5.1 61.91,39.05 61.59,38.73 24.45,38.73 R1.P$2
TCH_LED_2
  Top 0.152: R2.P$2 36.83,38.42 63.82,38.42 64.14,38.42 64.77,37.78 67.31,37.78 J5.3
TCH_LED_3
  Top 0.152: J5.5 69.53,37.47 65.72,37.47 64.45,37.47 63.82,38.1 46.35,38.1 44.45,36.19 R3.P$2
TCH_LED_4
  Top 0.152: J5.7 71.12,36.51 66.99,36.51 65.41,36.51 64.14,35.24 58.42,35.24 57.15,33.97 R4.P$2
TCH_LED_5
  Top 0.152: J5.9 75.88,39.05 73.03,36.19 70.17,33.34 R5.P$2
TCH_LED_6
  Top 0.152: J5.11 78.74,37.15 R6.P$2
TCH_LED_7
  Top 0.152: J5.13 85.09,35.24 91.76,35.24 93.34,35.24 R7.P$2
TCH_LED_8
  Top 0.152: J5.15 89.22,39.05 104.78,39.05 107.63,36.19 107.95,35.88 R8.P$2
TO_SWITCH_V
  Bottom 0.152: J4.6 69.85,15.24 69.85,13.02 71.75,11.11 74.3,8.57 77.15,8.57 98.42,8.57 99.38,7.62 99.38,3.49 U1.24
TO_SWITCH_VI
  Bottom 0.152: J4.8 72.39,15.24 72.39,11.11 74.61,8.89 100.33,8.89 101.92,7.3 101.92,3.49 U1.25
TO_SWITCH_VII
  Bottom 0.152: U1.26 104.14,5.71 100.65,9.21 75.56,9.21 74.93,9.84 74.93,15.24 J4.10
TO_SWT_III
  Bottom 0.152: U1.23 96.52,4.76 96.84,5.08 96.84,7.3 95.89,8.26 94.61,8.26 73.98,8.26 71.75,10.48 69.85,12.38 67.94,12.38 67.31,13.02 67.31,14.6 67.31,15.24 J4.4
TO_TCH_LED_1
  Top 0.152: J4.1 66.04,13.02 66.99,12.07 69.85,12.07 72.07,9.84 72.07,7.3 73.34,6.03 74.3,5.08 100.33,5.08 101.6,6.35 U1.4
TO_TCH_LED_2
  Top 0.152: J4.3 68.58,12.7 68.9,12.38 70.17,12.38 72.39,10.16 72.39,7.62 72.71,7.3 74.61,5.4 98.42,5.4 99.06,6.03 U1.5
TO_TCH_LED_3
  Top 0.152: U1.6 96.52,6.03 96.2,5.71 74.93,5.71 72.71,7.94 72.71,10.48 71.12,12.07 71.12,13.65 J4.5
TO_TCH_LED_4
  Top 0.152: J4.7 73.66,12.38 73.34,12.07 73.03,11.75 73.03,8.26 75.25,6.03 83.5,6.03 83.82,6.35 83.82,10.48 U1.11
TO_TCH_LED_5
  Bottom 0.152: U1.12 80.01,12.07 77.15,12.07 76.83,12.07 76.52,12.38 76.2,12.7 J4.9
TO_TCH_LED_6
  Top 0.152: U1.13 78.74,9.52 77.79,8.57 74.61,8.57 73.66,9.52 73.66,11.11 74.61,12.07 76.52,12.07 76.83,12.38 78.11,12.38 78.74,13.02 J4.11
TO_TCH_LED_7
  Top 0.152: U1.14 77.47,12.07 78.42,12.07 79.06,12.7 79.38,12.7 80.96,12.7 81.28,13.02 J4.13
TO_TCH_LED_8  (via drill 0.35)
  Top 0.152: J4.15 82.55,12.7 82.55,9.84 v82.55,6.67
  Bottom 0.152: U1.15 77.79,4.76 81.92,4.76 82.23,5.08 82.23,5.4 82.23,6.35 v82.55,6.67
TO_TOUCH0
  Bottom 0.152: J2.1 31.11,38.42 14.92,38.42 13.02,36.51 12.7,36.51 TCH_I.P$3_SLEEVE
TO_TOUCH1
  Bottom 0.152: J2.2 31.75,36.51 25.4,36.51 TCH_II.P$3_SLEEVE
TO_TOUCH2
  Bottom 0.152: TCH_III.P$3_SLEEVE J2.3
TO_TOUCH3
  Bottom 0.152: J2.4 40.64,38.1 42.23,36.51 50.8,36.51 TCH_IV.P$3_SLEEVE
TO_TOUCH4
  Bottom 0.152: J2.5 45.72,37.78 53.98,37.78 55.24,36.51 63.5,36.51 TCH_V.P$3_SLEEVE
TO_TOUCH5
  Bottom 0.152: J2.6 45.72,40.01 47.62,38.1 63.82,38.1 66.04,35.88 75.56,35.88 76.2,36.51 TCH_VI.P$3_SLEEVE
TO_TOUCH6
  Bottom 0.152: J2.7 48.26,39.05 48.9,38.42 64.14,38.42 64.77,37.78 77.15,37.78 78.42,36.51 88.9,36.51 TCH_VII.P$3_SLEEVE
TO_TOUCH7
  Bottom 0.152: J2.8 50.8,41.59 51.75,42.54 61.59,42.54 63.82,40.32 89.53,40.32 93.34,36.51 101.6,36.51 TCH_VIII.P$3_SLEEVE
TO_TOUCH8
  Top 0.152: J2.9 51.75,41.91 46.99,41.91 22.86,41.91 21.91,42.86 21.91,44.13 OCT_DWN.P$3_SLEEVE
TO_TOUCH9  (via drill 0.35)
  Top 0.152: J2.10 55.88,41.91 57.47,43.5 v57.47,46.99 | v58.74,48.58 60.33,48.58 v61.28,49.53
  Bottom 0.152: v57.47,46.99 58.74,48.26 v58.74,48.58 | v61.28,49.53 95.89,49.53 96.2,49.21 99.06,46.36 103.5,46.36 104.46,46.36 106.68,44.13 OCT_UP.P$3_SLEEVE
TX
  Bottom 0.406: U1.3 104.14,16.83 104.14,19.68 105.09,20.64 108.9,20.64 109.22,20.32 U$1.6

### Text on the board
_tsilk: V1.1 | DEGREE | GATE | OUT